# Altium schematic sheet LIDO-HW.100.InputStage_2.SchDoc
size A3; SheetNumber: 8; SheetTotal: 17
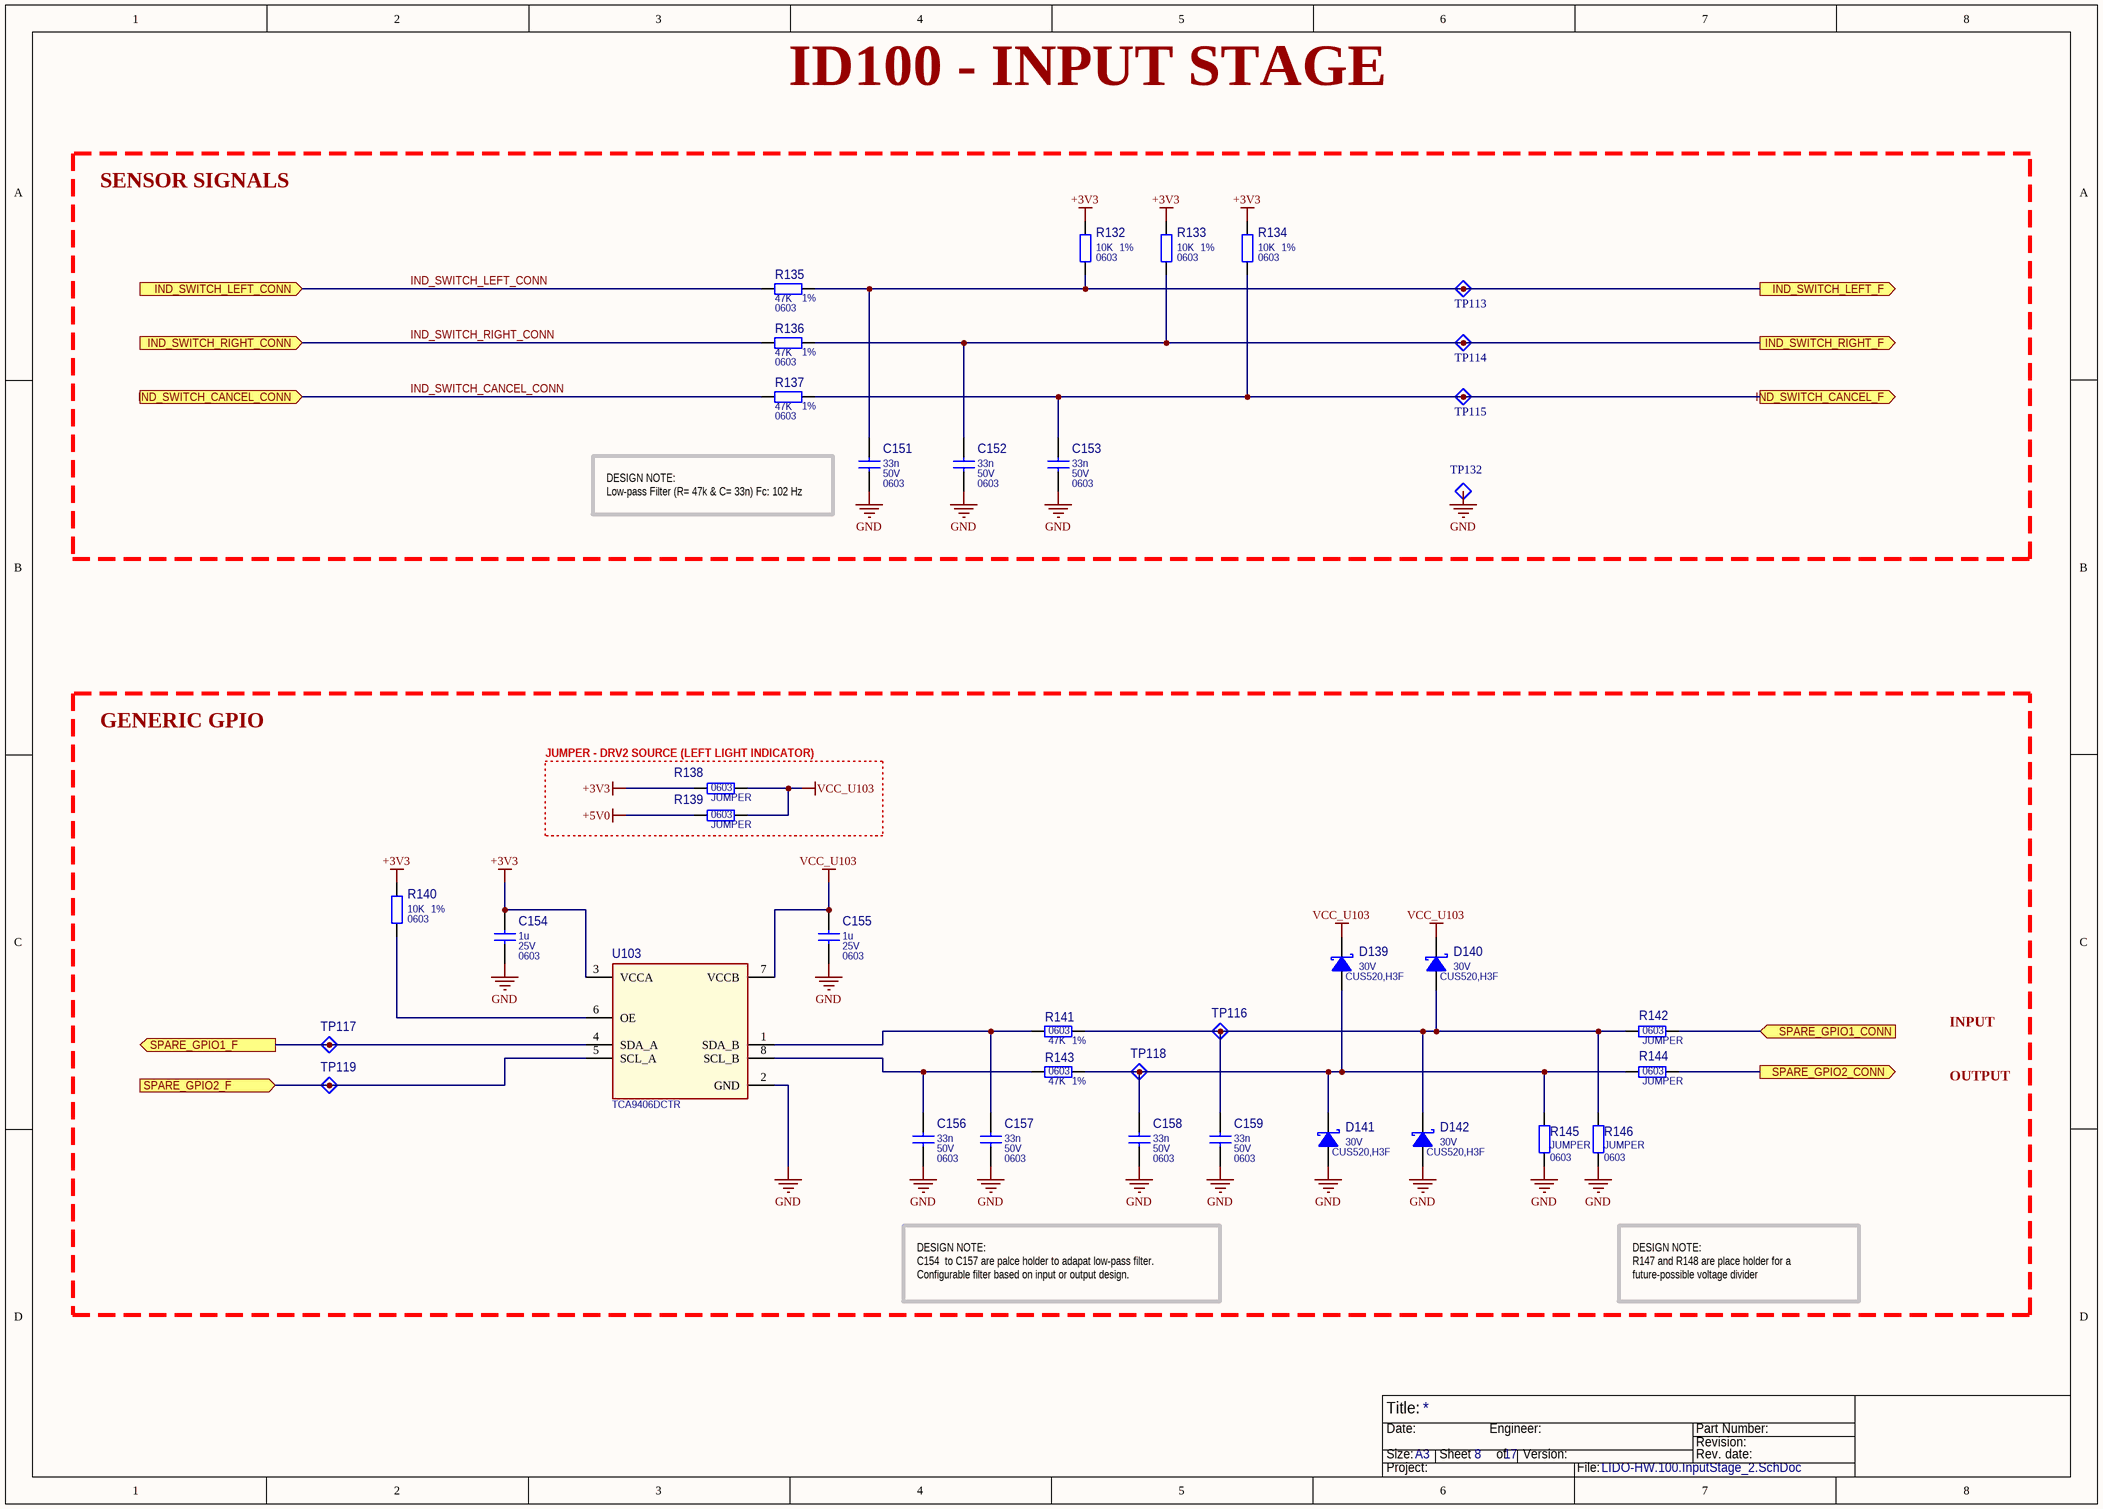
[diagram p0: LIDO-HW.100.InputStage_2.SchDoc]

## Parts
C151  33n  Part Value 2: 50V  Part Package: 0603  [CAP_0603_1608X90-N_MURATA_A]
C152  33n  Part Value 2: 50V  Part Package: 0603  [CAP_0603_1608X90-N_MURATA_A]
C153  33n  Part Value 2: 50V  Part Package: 0603  [CAP_0603_1608X90-N_MURATA_A]
C154  1u  Part Value 2: 25V  Part Package: 0603  [CAP_0603_1608X90-N_MURATA_A]
C155  1u  Part Value 2: 25V  Part Package: 0603  [CAP_0603_1608X90-N_MURATA_A]
C156  33n  Part Value 2: 50V  Part Package: 0603  [CAP_0603_1608X90-N_MURATA_A]
C157  33n  Part Value 2: 50V  Part Package: 0603  [CAP_0603_1608X90-N_MURATA_A]
C158  33n  Part Value 2: 50V  Part Package: 0603  [CAP_0603_1608X90-N_MURATA_A]
C159  33n  Part Value 2: 50V  Part Package: 0603  [CAP_0603_1608X90-N_MURATA_A]
D139  30V  Manufacturer Part Number: CUS520,H3F  [NXP_SOD-323_250X125X95L30x32_A]
D140  30V  Manufacturer Part Number: CUS520,H3F  [NXP_SOD-323_250X125X95L30x32_A]
D141  30V  Manufacturer Part Number: CUS520,H3F  [NXP_SOD-323_250X125X95L30x32_A]
D142  30V  Manufacturer Part Number: CUS520,H3F  [NXP_SOD-323_250X125X95L30x32_A]
R132  10K  Part Value 2: 1%  Part Package: 0603  [RES_0603_1608X60-N_YAGEO_A]
R133  10K  Part Value 2: 1%  Part Package: 0603  [RES_0603_1608X60-N_YAGEO_A]
R134  10K  Part Value 2: 1%  Part Package: 0603  [RES_0603_1608X60-N_YAGEO_A]
R135  47K  Part Value 2: 1%  Part Package: 0603  [RES_0603_1608X60-N_YAGEO_A]
R136  47K  Part Value 2: 1%  Part Package: 0603  [RES_0603_1608X60-N_YAGEO_A]
R137  47K  Part Value 2: 1%  Part Package: 0603  [RES_0603_1608X60-N_YAGEO_A]
R138  JUMPER  Part Package: 0603  [RES_0603_1608X60-N_YAGEO_A]
R139  JUMPER  Part Package: 0603  [RES_0603_1608X60-N_YAGEO_A]
R140  10K  Part Value 2: 1%  Part Package: 0603  [RES_0603_1608X60-N_YAGEO_A]
R141  47K  Part Value 2: 1%  Part Package: 0603  [RES_0603_1608X60-N_YAGEO_A]
R142  JUMPER  Part Package: 0603  [RES_0603_1608X60-N_YAGEO_A]
R143  47K  Part Value 2: 1%  Part Package: 0603  [RES_0603_1608X60-N_YAGEO_A]
R144  JUMPER  Part Package: 0603  [RES_0603_1608X60-N_YAGEO_A]
R145  JUMPER  Part Package: 0603  [RES_0603_1608X60-N_YAGEO_A]
R146  JUMPER  Part Package: 0603  [RES_0603_1608X60-N_YAGEO_A]
TP113  TestPoint_A  [TESTPOINT_1D_A]  (value not drawn)  (no BOM)
TP114  TestPoint_A  [TESTPOINT_1D_A]  (value not drawn)  (no BOM)
TP115  TestPoint_A  [TESTPOINT_1D_A]  (value not drawn)  (no BOM)
TP116  TestPoint_A  [TESTPOINT_1D_A]  (value not drawn)  (no BOM)
TP117  TestPoint_A  [TESTPOINT_1D_A]  (value not drawn)  (no BOM)
TP118  TestPoint_A  [TESTPOINT_1D_A]  (value not drawn)  (no BOM)
TP119  TestPoint_A  [TESTPOINT_1D_A]  (value not drawn)  (no BOM)
TP132  TestPoint_A  [TESTPOINT_1D_A]  (value not drawn)  (no BOM)
U103  TCA9406DCTR  [SSOP8P65_295X400X130L40X25-N_TI_A]

## Blocks framed on the sheet
SENSOR SIGNALS: C151-C153 R132-R137 TP113-TP115 TP132
GENERIC GPIO: C154-C159 D139-D142 R140-R146 TP116-TP119 U103
JUMPER - DRV2 SOURCE (LEFT LIGHT INDICATOR): R138 R139

## Ports
IND_SWITCH_CANCEL_CONN (in), IND_SWITCH_CANCEL_F (out), IND_SWITCH_LEFT_CONN (in), IND_SWITCH_LEFT_F (out), IND_SWITCH_RIGHT_CONN (in), IND_SWITCH_RIGHT_F (out), SPARE_GPIO1_CONN (in), SPARE_GPIO1_F (out), SPARE_GPIO2_CONN (out), SPARE_GPIO2_F (in)

## Nets
+3V3: C154.1 R132.2 R133.2 R134.2 R138.1 R140.2 U103.3(VCCA)
+5V0: R139.1
GND: C151.2 C152.2 C153.2 C154.2 C155.2 C156.2 C157.2 C158.2 C159.2 D141.A D142.A R145.1 R146.1 TP132.1(TP) U103.2(GND)
VCC_U103: C155.1 D139.C D140.C R138.2 R139.2 U103.7(VCCB)
IND_SWITCH_CANCEL_CONN: R137.1 ; port IND_SWITCH_CANCEL_CONN
IND_SWITCH_CANCEL_F: C153.1 R134.1 R137.2 TP115.1(TP) ; port IND_SWITCH_CANCEL_F
IND_SWITCH_LEFT_CONN: R135.1 ; port IND_SWITCH_LEFT_CONN
IND_SWITCH_LEFT_F: C151.1 R132.1 R135.2 TP113.1(TP) ; port IND_SWITCH_LEFT_F
IND_SWITCH_RIGHT_CONN: R136.1 ; port IND_SWITCH_RIGHT_CONN
IND_SWITCH_RIGHT_F: C152.1 R133.1 R136.2 TP114.1(TP) ; port IND_SWITCH_RIGHT_F
SPARE_GPIO1_CONN: R142.2 ; port SPARE_GPIO1_CONN
SPARE_GPIO1_F: TP117.1(TP) U103.4(SDA_A) ; port SPARE_GPIO1_F
SPARE_GPIO2_CONN: R144.2 ; port SPARE_GPIO2_CONN
SPARE_GPIO2_F: TP119.1(TP) U103.5(SCL_A) ; port SPARE_GPIO2_F
NetC156_1: C156.1 R143.1 U103.8(SCL_B)
NetC157_1: C157.1 R141.1 U103.1(SDA_B)
NetC158_1: C158.1 D139.A D141.C R143.2 R144.1 R145.2 TP118.1(TP)
NetC159_1: C159.1 D140.A D142.C R141.2 R142.1 R146.2 TP116.1(TP)
NetR140_1: R140.1 U103.6(OE)

## Notes on the sheet
- ID100 - INPUT STAGE
- DESIGN NOTE:
  Low-pass Filter (R= 47k & C= 33n) Fc: 102 Hz
- INPUT
- OUTPUT
- DESIGN NOTE:
  C154  to C157 are palce holder to adapat low-pass filter.
  Configurable filter based on input or output design.
- DESIGN NOTE:
  R147 and R148 are place holder for a future-possible voltage divider
- Title:
- Size:
- Date:
- A3
- Sheet       of
- Engineer:
- Version:
- Part Number:
- Revision:
- Rev. date:
- Project:
- File:

## Library data of the parts
C151-C153 C156-C159 = 80: CAP CER 0.033UF 50V X7R 0603; Manufacturer Part Number: CGA3E2X7R1H333K080AA; Manufacturer: TDK Corporation; Manufacturer Part Number 2nd: CL10B333KB8WPNC; Manufacturer 2nd: Samsung Electro-Mechanics; Obsolete Part: False; Component ID: 80; Part Value: 33n; Part Value 3: X7R; Package Type: SMT
C154 C155 = 78: CAP CER 1UF 25V X7R 0603; Manufacturer Part Number: CGA3E1X7R1E105M080AE; Manufacturer: TDK Corporation; Obsolete Part: False; Component ID: 78; Part Value: 1u; Part Value 3: X7R; Package Type: SMT
D139-D142 = 17: DIODE SCHOTTKY 30V 200MA; Manufacturer: Toshiba Semiconductor and Storage; Part Package: SOD-323; Obsolete Part: False; Component ID: 17; Part Value: 30V; Part Value 2: 200mA; Package Type: SMT
R132-R134 R140 = 115: RES 10K OHM 1% 1/10W 0603; Manufacturer Part Number: RC0603FR-0710KL; Manufacturer: YAGEO; Obsolete Part: False; Component ID: 115; Part Value: 10K; Part Value 3: 1/10W; Package Type: SMT
R135-R137 R141 R143 = 107: RES SMD 47K OHM 1% 1/10W 0603; Manufacturer Part Number: ERJ-3EKF4702V; Manufacturer: Panasonic Electronic Components; Obsolete Part: False; Component ID: 107; Part Value: 47K; Part Value 3: 1/10W; Package Type: SMT
R138 R139 R142 R144-R146 = 9: RES 0 OHM JUMPER 1/10W 0603; Manufacturer Part Number: RC0603JR-070RL; Manufacturer: YAGEO; Manufacturer Part Number 2nd: RMCF0603ZT0R00; Manufacturer 2nd: Stackpole Electronics Inc; Obsolete Part: False; Component ID: 9; Part Value: JUMPER; Part Value 2: 5%; Part Value 3: 1/10W; Package Type: SMT
TP113-TP119 TP132 = 3: Pad Diamater 1mm; Part: Test Point 1D A; Obsolete Part: False; 00_Name: TP_XXmm; Component ID: 3; 02_Layer: *; 01_Diameter: 1mm
U103 = 6: Voltage Level Translator Bidirectional 1 Circuit 2 Channel 24Mbps SM8; Manufacturer: Texas Instruments; Part Package: MSOP-8; Obsolete Part: False; Component ID: 6; Manufacturer Part Number: TCA9406DCTR; Part Type: Level Translator; Part Value: TCA9406DCTR; Package Type: SMT